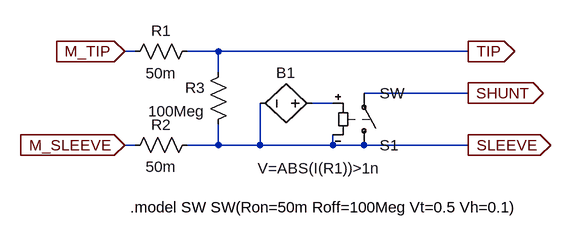
[diagram p0: schematic JackAudio2.asc]
JackAudio2.asc, the LTspice schematic file:
Version 4
SHEET 1 932 680
WIRE -32 112 -48 112
WIRE 96 112 48 112
WIRE 480 112 96 112
WIRE 96 144 96 112
WIRE 480 176 320 176
WIRE 272 192 240 192
WIRE -32 256 -48 256
WIRE 96 256 96 224
WIRE 96 256 48 256
WIRE 160 256 160 192
WIRE 160 256 96 256
WIRE 272 256 272 240
WIRE 272 256 160 256
WIRE 320 256 272 256
WIRE 480 256 320 256
FLAG -48 256 M_SLEEVE
IOPIN -48 256 In
FLAG -48 112 M_TIP
IOPIN -48 112 In
FLAG 480 256 SLEEVE
IOPIN 480 256 Out
FLAG 480 112 TIP
IOPIN 480 112 Out
FLAG 480 176 SHUNT
IOPIN 480 176 Out
SYMBOL sw 320 272 M180
SYMATTR InstName S1
SYMBOL res -48 272 R270
WINDOW 0 32 56 VTop 2
WINDOW 3 -2 56 VBottom 2
SYMATTR InstName R2
SYMATTR Value 50m
SYMBOL res -48 128 R270
WINDOW 0 32 56 VTop 2
WINDOW 3 -2 56 VBottom 2
SYMATTR InstName R1
SYMATTR Value 50m
SYMBOL res 112 128 M0
SYMATTR InstName R3
SYMATTR Value 100Meg
SYMBOL bv 256 192 M270
WINDOW 0 32 56 VTop 2
WINDOW 3 -115 5 VTop 2
SYMATTR InstName B1
SYMATTR Value V=ABS(I(R1))>1n
TEXT -40 352 Left 2 !.model SW SW(Ron=50m Roff=100Meg Vt=0.5 Vh=0.1)

The netlist it stands for:
* JackAudio2.asc
S1 SLEEVE SHUNT N001 SLEEVE SW
R2 M_SLEEVE SLEEVE 50m
R1 M_TIP TIP 50m
R3 TIP SLEEVE 100Meg
B1 N001 SLEEVE V=ABS(I(R1))>1n
.model SW SW(Ron=50m Roff=100Meg Vt=0.5 Vh=0.1)
.backanno
.end